# EAGLE design Boardd (EAGLE 9.6.2)
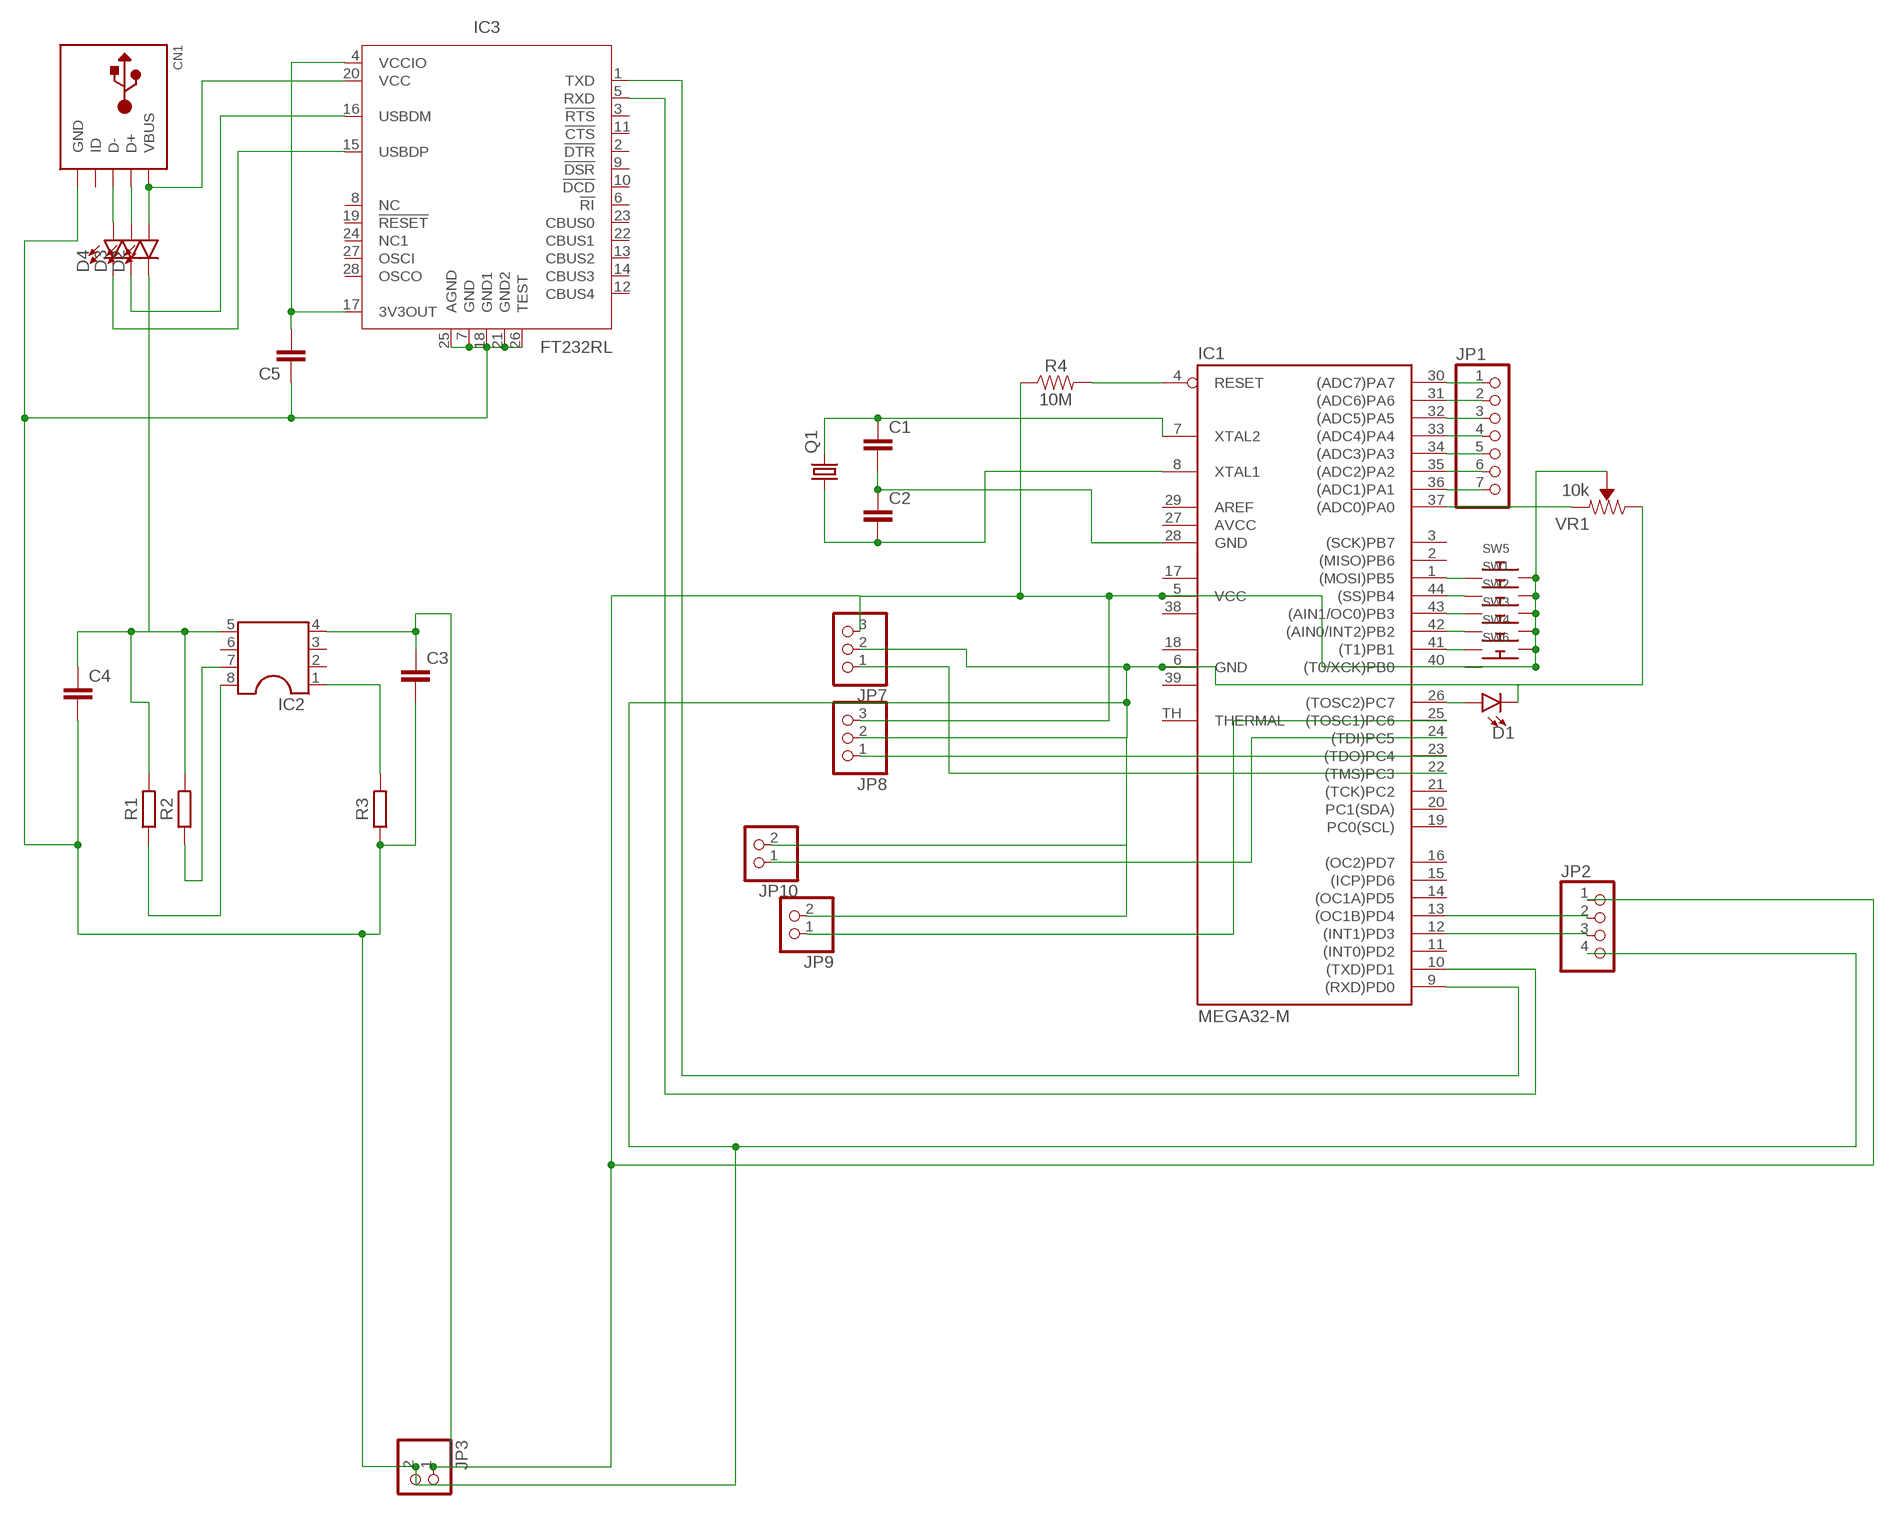
[diagram p0: schematic, sheet 1]

## Parts
C1  C2,5-3  [C2.5-3]
C2  C2,5-3  [C2.5-3]
C3  C2.5/2  [C2.5-2]
C4  C2.5/2  [C2.5-2]
C5  C2,5-3  [C2.5-3]
CN1  USBMINIB  [USB-MINIB]
D1  LED0603  [LED-0603]
D2  LED0603  [LED-0603]
D3  LED0603  [LED-0603]
D4  LED0603  [LED-0603]
IC1  MEGA32-M  [MLF44-TH]
IC2  DIL8  [DIL08]
IC3  FT232RL  FT232RL_SSOP  [SSOP28]
JP1  PINHD-1X7  [1X07]
JP2  PINHD-1X4  [1X04]
JP3  PINHD-1X2  [1X02]
JP7  PINHD-1X3  [1X03]
JP8  PINHD-1X3  [1X03]
JP9  PINHD-1X2  [1X02]
JP10  PINHD-1X2  [1X02]
Q1  CRYSTALHC49S  [HC49/S]
R1  R_CHIP-0603(1608-METRIC)  [RESC1608X60]
R2  R_CHIP-0603(1608-METRIC)  [RESC1608X60]
R3  R_CHIP-0603(1608-METRIC)  [RESC1608X60]
R4  10M  10MOHM-0603-1/10W-5%  [0603]
SW1  SWITCH_PUSHBUTTONSOFTTOUCHSMD_SJ  [PUSHBUTTON_SMD_SJ]
SW2  SWITCH_PUSHBUTTONSOFTTOUCHSMD_SJ  [PUSHBUTTON_SMD_SJ]
SW3  SWITCH_PUSHBUTTONSOFTTOUCHSMD_SJ  [PUSHBUTTON_SMD_SJ]
SW4  SWITCH_PUSHBUTTONSOFTTOUCHSMD_SJ  [PUSHBUTTON_SMD_SJ]
SW5  SWITCH_PUSHBUTTONSOFTTOUCHSMD_SJ  [PUSHBUTTON_SMD_SJ]
SW6  SWITCH_PUSHBUTTONSOFTTOUCHSMD_SJ  [PUSHBUTTON_SMD_SJ]
VR1  10k  TRIMPOT-SMD-3MM-CLOSED-1/8W-20%  [TRIMPOT-SMD-3MM-CLOSED]

## Nets
N$1: IC1.1((MOSI)PB5) SW5.P$1
N$2: IC1.44((SS)PB4) SW1.P$1
N$3: IC1.43((AIN1/OC0)PB3) SW2.P$1
N$4: IC1.42((AIN0/INT2)PB2) SW3.P$1
N$5: D1.A IC1.26((TOSC2)PC7)
N$6: IC1.41((T1)PB1) SW4.P$1
N$7: IC1.40((T0/XCK)PB0) SW6.P$1
N$8: C1.2 C2.1 IC1.28(GND)
N$9: C1.1 IC1.7(XTAL2) Q1.2
N$10: C2.2 IC1.8(XTAL1) Q1.1
N$11: IC1.37((ADC0)PA0) VR1.1(CCW)
N$12: IC1.30((ADC7)PA7) JP1.1
N$13: IC1.31((ADC6)PA6) JP1.2
N$14: IC1.32((ADC5)PA5) JP1.3
N$15: IC1.13((OC1B)PD4) JP2.2
N$16: IC1.12((INT1)PD3) JP2.3
N$17: IC1.33((ADC4)PA4) JP1.4
N$18: IC1.34((ADC3)PA3) JP1.5
N$19: IC1.35((ADC2)PA2) JP1.6
N$20: IC1.36((ADC1)PA1) JP1.7
N$21: C3.1 IC1.5(VCC) IC2.4 JP2.1 JP3.1 JP7.3 JP8.3 R4.1 SW1.P$2 SW2.P$2 SW3.P$2 SW4.P$2 SW5.P$2 SW6.P$2 VR1.2(WIPER)
N$22: CN1.VBUS D2.A IC3.20(VCC)
N$23: IC1.25((TOSC1)PC6) JP9.1
N$24: IC1.24((TDI)PC5) JP10.1
N$25: IC1.4(RESET) R4.2
N$26: CN1.D+ D3.A
N$27: CN1.D- D4.A
N$28: D3.C IC3.16(USBDM)
N$29: D4.C IC3.15(USBDP)
N$30: C3.2 C4.2 C5.1 CN1.GND D1.C IC1.6(GND) IC3.7(GND) IC3.18(GND1) IC3.21(GND2) IC3.25(AGND) IC3.26(TEST) JP2.4 JP3.2 JP7.2 JP8.2 JP9.2 JP10.2 R3.1 VR1.3(CW)
N$31: IC1.10((TXD)PD1) IC3.5(RXD)
N$32: IC1.9((RXD)PD0) IC3.1(TXD)
N$33: C5.2 IC3.4(VCCIO) IC3.17(3V3OUT)
N$34: IC1.23((TDO)PC4) JP8.1
N$35: IC1.22((TMS)PC3) JP7.1
N$78: IC2.1 R3.2
N$79: IC2.8 R1.1
N$80: IC2.7 R2.1
N$81: C4.1 D2.C IC2.5 R1.2 R2.2
Unconnected: CN1.ID IC1.2((MISO)PB6) IC1.3((SCK)PB7) IC1.11((INT0)PD2) IC1.14((OC1A)PD5) IC1.15((ICP)PD6) IC1.16((OC2)PD7) IC1.19(PC0(SCL)) IC1.20(PC1(SDA)) IC1.21((TCK)PC2) IC1.29(AREF) IC1.TH(THERMAL) IC2.2 IC2.3 IC2.6 IC3.2(!DTR) IC3.3(!RTS) IC3.6(!RI) IC3.8(NC) IC3.9(!DSR) IC3.10(!DCD) IC3.11(!CTS) IC3.12(CBUS4) IC3.13(CBUS2) IC3.14(CBUS3) IC3.19(!RESET) IC3.22(CBUS1) IC3.23(CBUS0) IC3.24(NC1) IC3.27(OSCI) IC3.28(OSCO)

## Power pins joined to a net without a drawn wire
AVCC: IC1.27(AVCC)
GND1: IC1.18(GND1)
GND2: IC1.39(GND2)
VCC1: IC1.17(VCC1)
VCC2: IC1.38(VCC2)

## Library data of the parts
C1-C5 = capacitor-wima:C: CAPACITOR naming: grid - package width
CN1 = adafruit:USB: USB Connectors USBMINIB - Surface Mount Female Mini-B USB Connector 4UConnector: 06564 By microbuilder.eu Thru-hole RA Female Mini-B USB Connector 4UConnector: 18732 By ladyada.net
D1-D4 = SparkFun-LED:LED: LED (Generic) Standard schematic elements and footprints for 5mm, 3mm, 1206, and 0603 sized LEDs. Generic LEDs with no color specified.
IC1 = atmel:MEGA32-M: MICROCONTROLLER 32 Kbytes FLASH 2 Kbytes SRAM 1 Kbytes EEPROM USART 8-channel 10 bit ADC Source: www.atmel.com .. doc2503.pdf; MPN: ATMEGA32-16MU; OC_FARNELL: 1455108; OC_NEWARK: 58M3733
IC2 = ic-package:DIL8: Dual In Line / Socket
IC3 = IC_Interface:FT232RL: USB Bridge, USB to UART USB 2.0 UART Interface Datasheet <https://www.ftdichip.com/Support/Documents/DataSheets/ICs/DS_FT232R.pdf>; CATEGORY: IC_Interface; MANUFACTURER: FTDI Chip; MPN: FT232RL; OPERATING_TEMP: -40 to 85°C; PART_STATUS: Active; ROHS_COMPLIANT: Compliant; SUB-CATEGORY: Controller; THERMALLOSS: 0.5W; TYPE: USB to UART
JP1 = pinhead:PINHD-1X7: PIN HEADER
JP2 = pinhead:PINHD-1X4: PIN HEADER
JP3 JP9 JP10 = pinhead:PINHD-1X2: PIN HEADER
JP7 JP8 = pinhead:PINHD-1X3: PIN HEADER
Q1 = adafruit:CRYSTAL: CRYSTAL; OC_FARNELL: 1667008; OC_NEWARK: unknown
R1-R3 = Resistor:R: Resistor Fixed - Generic; CATEGORY: Resistor; SUB-CATEGORY: Fixed
R4 = SparkFun-Resistors:10MOHM: RES-09327; PROD_ID: RES-08283
SW1-SW6 = adafruit:SWITCH_PUSHBUTTON: Buttons SOFTTOUCHSMD_SJ - Soft touch temporary push button (Super Junk Akihabara) Compatible with SKPMANE010 [Mouser: 688-SKPMAN] C&K_KSS = Digikey: KSS221GLFS
VR1 = SparkFun-Resistors:TRIMPOT: Trimming Potentiometer (Trimpot) Three-terminal potentiometers, with an adjustable wiper and two adjustable resistors. A pot can be used to create a configurable voltage divider, or as a variable resistor. "Trimpots" are a subset of potentiometers, usually intended for "set-and-forget" applications. They're often more delicate than standard potentiometers - rated for fewer turns. Variants PTH-KNOB - PTH Trimpot w/ finger-adjustable knob Trimpot 10K with Knob <https://www.sparkfun.com/products/9806> (COM-09806) Datasheet <http://www.sparkfun.com/datasheets/Components/General/TSR-3386.pdf> SMD-3MM-CLOSED-FRAME - SMD 3mm Square Closed-Frame Trimpot Used on e.g. EasyDriver - Stepper Motor Driver <https://www.sparkfun.com/products/12779> Datasheet <http://www.bitechnologies.com/pdfs/22.pdf> (22AR10KTR) SMD-5MM - SMD 5mm Square Closed-Frame Trimpot Used on e.g. IOIO-OTG - V2.2 <https://www.sparkfun.com/products/13613> Datasheet <http://www.vishay.com/docs/51008/ts53.pdf> (TS53YL502MR10) SMD-3MM-1/10W-25% - 3mm Square Open-Frame Trimpot Used on e.g. SparkFun Shapeoko <https://www.sparkfun.com/products/13899> Datasheet <http://www.bourns.com/docs/Product-Datasheets/TC33.pdf> (TC33X-2-103E); PROD_ID: RES-09285

## Board
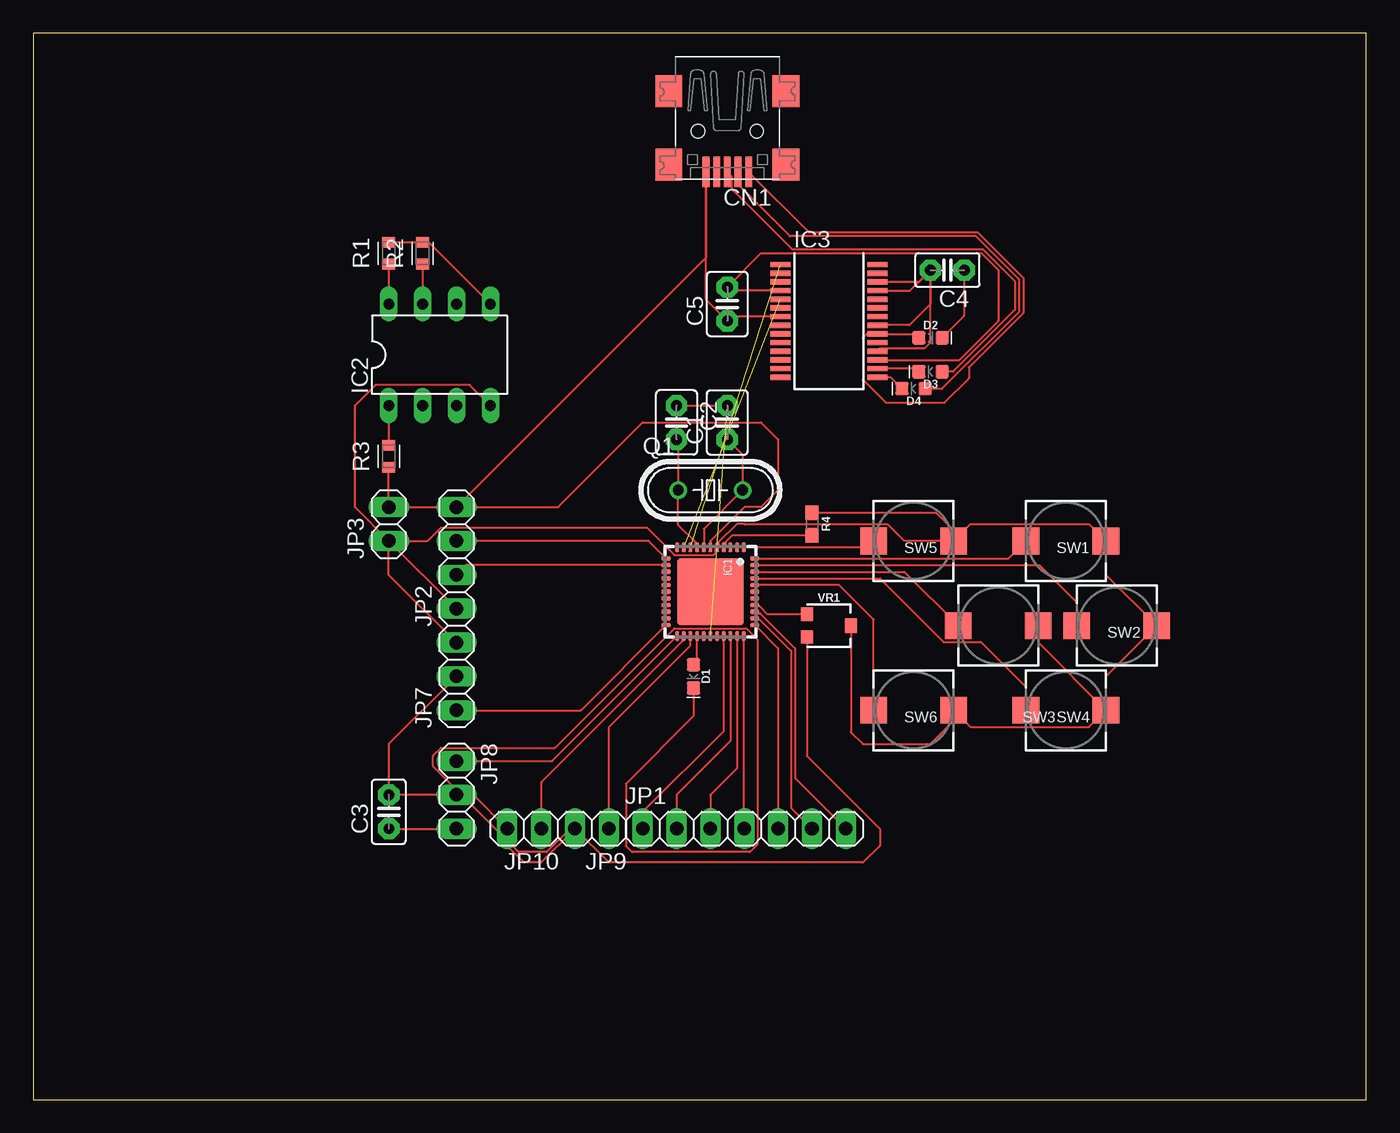
[diagram p1: board, top side]
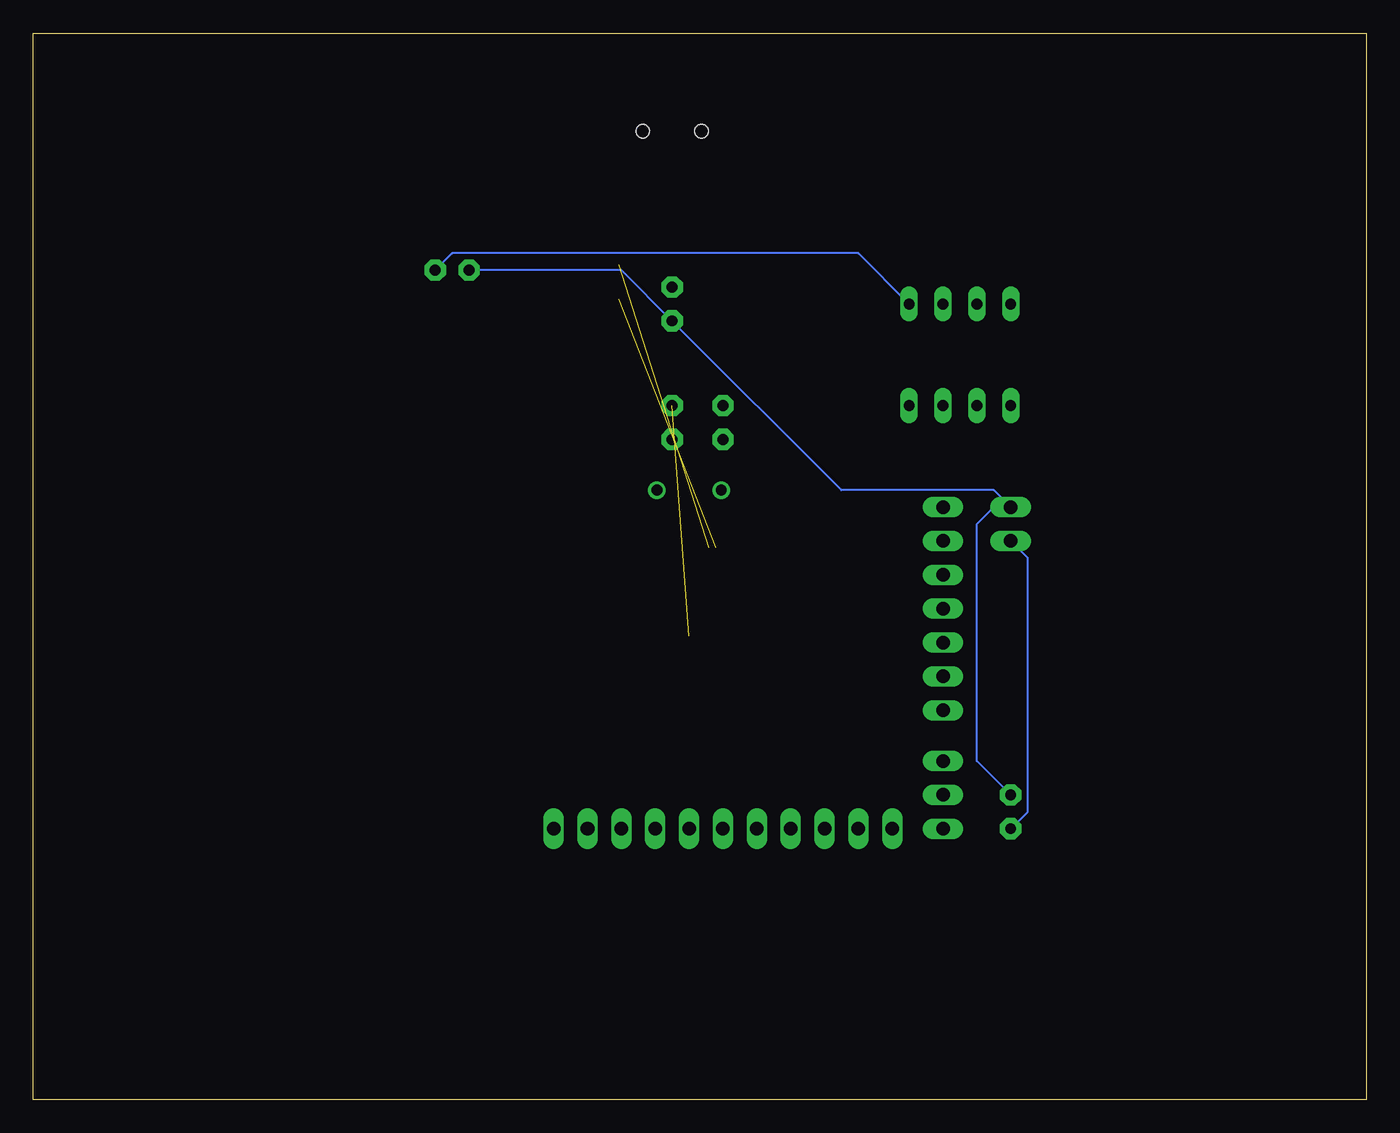
[diagram p2: board, bottom side, seen from below]

Size 100 x 80 mm. Coordinates in mm from the lower left corner, seen from the top.
Outline: 0,0 100,0 100,80 0,80 0,0
Copper layers (1*16): Top 0.035mm / dielectric 1.5mm / Bottom 0.035mm
Design rules "default": minimum track width 6mil, minimum drill 0.35mm, track to track 6mil, track to pad 6mil, pad to pad 6mil, via to via 6mil, smd to smd 6mil, copper to edge 40mil, drill to drill 6mil, minimum pad ring 10mil, minimum via ring 8mil, stop-mask expansion 4mil, vias tented up to drill 0mil, thermal gap 10mil

### Footprints (pad centres in the part's own frame; a part is rotated, then mirrored left to right if it is on the bottom)
C2.5-3 = drill 0.813 pad 1.6 octagon: 1 -1.27,0; 2 1.27,0
C2.5-2 = drill 0.813 pad 1.6 octagon: 1 -1.27,0; 2 1.27,0
USB-MINIB = smd 0.5 x 2.308: D+ 0,4.064; D- -0.8,4.064; GND 1.6,4.064; ID 0.8,4.064; VBUS -1.6,4.064 | smd 2 x 2.4: GND1 -4.4,-2; GND2 -4.4,3.5; GND3 4.4,3.5; GND4 4.4,-2 | hole 1: -2.2,1; 2.2,1
LED-0603 = smd 1 x 1: A -0.877,0; C 0.877,0
MLF44-TH = smd 0.7 x 0.3: 1 -3.325,2.5; 2 -3.325,2; 3 -3.325,1.5; 4 -3.325,1; 5 -3.325,0.5; 6 -3.325,0; 7 -3.325,-0.5; 8 -3.325,-1; 9 -3.325,-1.5; 10 -3.325,-2; 11 -3.325,-2.5; 23 3.325,-2.5; 24 3.325,-2; 25 3.325,-1.5; 26 3.325,-1; 27 3.325,-0.5; 28 3.325,0; 29 3.325,0.5; 30 3.325,1; 31 3.325,1.5; 32 3.325,2; 33 3.325,2.5 | smd 0.3 x 0.7: 12 -2.5,-3.325; 13 -2,-3.325; 14 -1.5,-3.325; 15 -1,-3.325; 16 -0.5,-3.325; 17 0,-3.325; 18 0.5,-3.325; 19 1,-3.325; 20 1.5,-3.325; 21 2,-3.325; 22 2.5,-3.325; 34 2.5,3.325; 35 2,3.325; 36 1.5,3.325; 37 1,3.325; 38 0.5,3.325; 39 0,3.325; 40 -0.5,3.325; 41 -1,3.325; 42 -1.5,3.325; 43 -2,3.325; 44 -2.5,3.325 | smd 5 x 5: TH 0,0
DIL08 = drill 0.813 long: 1 -3.81,-3.81; 2 -1.27,-3.81; 3 1.27,-3.81; 4 3.81,-3.81; 5 3.81,3.81; 6 1.27,3.81; 7 -1.27,3.81; 8 -3.81,3.81
SSOP28 = smd 0.4 x 1.5: 1 -4.225,-3.625; 2 -3.575,-3.625; 3 -2.925,-3.625; 4 -2.275,-3.625; 5 -1.625,-3.625; 6 -0.975,-3.625; 7 -0.325,-3.625; 8 0.325,-3.625; 9 0.975,-3.625; 10 1.625,-3.625; 11 2.275,-3.625; 12 2.925,-3.625; 13 3.575,-3.625; 14 4.225,-3.625; 15 4.225,3.625; 16 3.575,3.625; 17 2.925,3.625; 18 2.275,3.625; 19 1.625,3.625; 20 0.975,3.625; 21 0.325,3.625; 22 -0.325,3.625; 23 -0.975,3.625; 24 -1.625,3.625; 25 -2.275,3.625; 26 -2.925,3.625; 27 -3.575,3.625; 28 -4.225,3.625
1X07 = drill 1.016 long: 1 -7.62,0; 2 -5.08,0; 3 -2.54,0; 4 0,0; 5 2.54,0; 6 5.08,0; 7 7.62,0
1X04 = drill 1.016 long: 1 -3.81,0; 2 -1.27,0; 3 1.27,0; 4 3.81,0
1X02 = drill 1.016 long: 1 -1.27,0; 2 1.27,0
1X03 = drill 1.016 long: 1 -2.54,0; 2 0,0; 3 2.54,0
HC49/S = drill 0.813: 1 -2.413,0; 2 2.413,0
RESC1608X60 = smd 0.799 x 0.974: 1 -0.815,0; 2 0.815,0
0603 = smd 1.1 x 1: 1 -0.85,0; 2 0.85,0
PUSHBUTTON_SMD_SJ = smd 2 x 2: P$1 3,0; P$2 -3,0
TRIMPOT-SMD-3MM-CLOSED = smd 1 x 0.9: 1 -0.85,-1.65; 3 0.85,-1.65 | smd 1.1 x 0.9: 2 0,1.65

### Placement (x,y rotation side)
C1  52.07,50.8 90 top
C2  48.26,50.8 270 top
C3  26.67,21.59 90 top
C4  68.58,62.23 180 top
C5  52.07,59.69 90 top
CN1  52.07,73.66 180 top
D1  49.53,31.75 270 top
D2  67.31,57.15 0 top
D3  67.31,54.61 180 top
D4  66.04,53.34 180 top
IC1  50.8,38.1 270 top
IC2  30.48,55.88 0 top
IC3  59.69,58.42 270 top
JP1  53.34,20.32 0 top
JP2  31.75,40.64 90 top
JP3  26.67,43.18 90 top
JP7  31.75,31.75 90 top
JP8  31.75,22.86 270 top
JP9  41.91,20.32 180 top
JP10  36.83,20.32 180 top
Q1  50.8,45.72 0 top
R1  26.67,63.5 90 top
R2  29.21,63.5 90 top
R3  26.67,48.26 90 top
R4  58.42,43.18 270 top
SW1  77.47,41.91 180 top
SW2  81.28,35.56 180 top
SW3  72.39,35.56 180 top
SW4  77.47,29.21 180 top
SW5  66.04,41.91 180 top
SW6  66.04,29.21 180 top
VR1  59.69,35.56 270 top

### Tracks (layer width: path | path; a pad name or v marks a point on that pad's centre or on a via)
N$1
  Top 0.152: SW5.P$1 62.55,41.42 IC1.1
N$2
  Top 0.152: IC1.44 73.16,40.6 SW1.P$1
N$3
  Top 0.152: IC1.43 75.47,40.1 78.28,37.29 SW2.P$1
N$4
  Top 0.152: IC1.42 65.35,39.6 SW3.P$1
N$5
  Top 0.152: IC1.26 49.8,32.9 D1.A
N$6
  Top 0.152: IC1.41 63.53,39.1 68.3,34.33 71.08,34.33 74.47,30.94 SW4.P$1
N$7
  Top 0.152: SW6.P$1 63.04,36.02 60.46,38.6 IC1.40
N$8  (1 unrouted)
  Top 0.152: C2.1 C1.2
N$9
  Top 0.152: IC1.7 50.3,42.81 Q1.2 53.21,48.39 C1.1
N$10
  Top 0.152: IC1.8 49.68,41.55 49.68,41.83 48.39,43.12 Q1.1 48.39,49.4 C2.2
N$11
  Top 0.152: IC1.37 54.25,36.98 54.53,36.98 55.09,36.41 VR1.1
N$12
  Top 0.152: JP1.1 45.72,21.59 51.8,27.67 IC1.30
N$13
  Top 0.152: IC1.31 52.3,26.9 48.26,22.86 JP1.2
N$14
  Top 0.152: IC1.32 52.8,24.86 50.8,22.86 JP1.3
N$15
  Top 0.152: IC1.13 32.48,40.1 JP2.2
N$16
  Top 0.152: IC1.12 46.16,41.91 JP2.3
N$17
  Top 0.152: JP1.4 53.3,20.36 IC1.33
N$18
  Top 0.152: IC1.34 55.88,33.84 JP1.5
N$19
  Top 0.152: JP1.6 56.84,21.89 56.84,33.66 54.53,35.98 54.25,35.98 IC1.35
N$20
  Top 0.152: IC1.36 54.25,36.48 54.53,36.48 57.15,33.85 57.15,24.13 JP1.7
N$21
  Top 0.152: SW6.P$2 69.44,28.8 | 69.44,28.8 70.31,27.94 79.2,27.94 SW4.P$2 | SW4.P$2 80.47,31.75 SW2.P$2 80.47,39.37 SW1.P$2 79.2,43.18 70.31,43.18 69.44,42.31 | SW4.P$2 75.39,34.29 SW3.P$2 | 69.44,42.31 SW5.P$2 65.36,41.91 64.14,43.14 53.38,43.14 53.34,43.18 52.78,43.18 51.42,41.83 51.42,41.55 IC1.5 51.18,41.3 51.18,41.02 51,40.85 48.1,40.85 46.05,42.9 30.58,42.9 29.59,41.91 JP3.1 | VR1.2 61.34,27.56 62.23,26.67 67.31,26.67 69.44,28.8 | JP2.1 JP3.1 | JP7.3 26.67,39.37 JP3.1 | C3.1 JP8.3 | JP3.1 24.13,44.45 24.13,52.07 25.68,53.62 32.74,53.62 IC2.4 | R4.1 67.73,44.03 69.44,42.31
  Bottom 0.152: C3.1 25.4,21.59 25.4,40.64 JP3.1
N$22
  Top 0.152: D2.A 66.14,57.45 IC3.20 62.52,57.45 62.23,57.15 62.23,54.01 63.95,52.28 68.37,52.28 70.19,54.1 70.19,54.92 74.27,59.01 74.27,61.64 70.84,65.08 58.19,65.08 CN1.VBUS
N$23
  Top 0.152: JP9.1 43.18,27.94 49.3,34.06 IC1.25
N$24
  Top 0.152: IC1.24 48.68,34.65 48.68,34.37 38.1,23.8 JP10.1
N$25
  Top 0.152: IC1.4 51.92,41.55 51.92,41.83 52.43,42.33 R4.2
N$26
  Top 0.152: CN1.D+ 52.39,69.28 52.39,68.35 56.93,63.8 71.25,63.8 73.66,61.39 73.66,59.26 69.01,54.61 D3.A
N$27
  Top 0.152: D4.A 68.17,53.34 73.97,59.13 73.97,61.52 70.71,64.77 56.77,64.77 52.87,68.67 CN1.D-
N$28
  Top 0.152: D3.C 66.2,54.84 IC3.16
N$29
  Top 0.152: IC3.15 64.31,54.2 D4.C
N$30
  Top 0.152: R3.1 JP3.2 JP2.4 | JP7.2 26.67,26.67 C3.2 JP8.2 33.02,22.86 JP10.2 35.56,19.05 36.83,17.78 38.1,17.78 JP9.2 | VR1.3 58.04,25.78 63.5,20.32 63.5,19.05 62.23,17.78 43.18,17.78 JP9.2 | JP2.4 39.37,44.45 45.72,50.8 54.61,50.8 55.88,49.53 55.88,45.72 54.61,44.45 53.34,44.45 50.8,41.91 IC1.6 | IC3.7 52.4,58.74 C5.1 50.47,60.02 CN1.GND 50.47,63.17 JP2.4 | C4.2 66.42,61.34 IC3.26 | IC3.25 65.78,60.7 C4.2 | C4.2 67.31,59.69 65.72,58.09 IC3.21 | IC3.18 63.54,56.37 66.89,56.37 67.31,56.79 C4.2 | JP9.2 40.26,20.32 38.51,18.57 36.42,18.57 30,24.99 30,25.81 30.58,26.39 39.14,26.39 48.1,35.35 53.5,35.35 54.33,34.52 54.33,19.15 53.75,18.57 44.93,18.57 44.45,19.05 44.45,23.7 49.53,28.78 D1.C
  Bottom 0.152: C4.2 55.88,62.23 C5.1 39.37,45.72 27.94,45.72 JP3.2 27.94,44.45 29.21,43.18 29.21,25.4 C3.2
N$31  (1 unrouted)
N$32  (1 unrouted)
N$33
  Top 0.152: IC3.4 52.34,60.7 C5.2 54.61,63.5 71.12,63.5 72.39,62.23 72.39,58.42 69.47,55.49 IC3.17
N$34
  Top 0.152: JP8.1 38.92,25.4 IC1.23
N$35
  Top 0.152: JP7.1 41.09,29.21 IC1.22
N$78
  Top 0.152: IC2.1 R3.2
N$79
  Top 0.152: R1.1 IC2.8
N$80
  Top 0.152: R2.1 IC2.7
N$81
  Top 0.152: R1.2 R2.2 29.66,64.31 IC2.5 | D2.C 69.85,58.81 C4.1
  Bottom 0.152: IC2.5 38.1,63.5 68.58,63.5 C4.1